# EAGLE design supply_test_2v0 (EAGLE 6.3)

## Sheet 1 of 3: AC-DC Power Supply
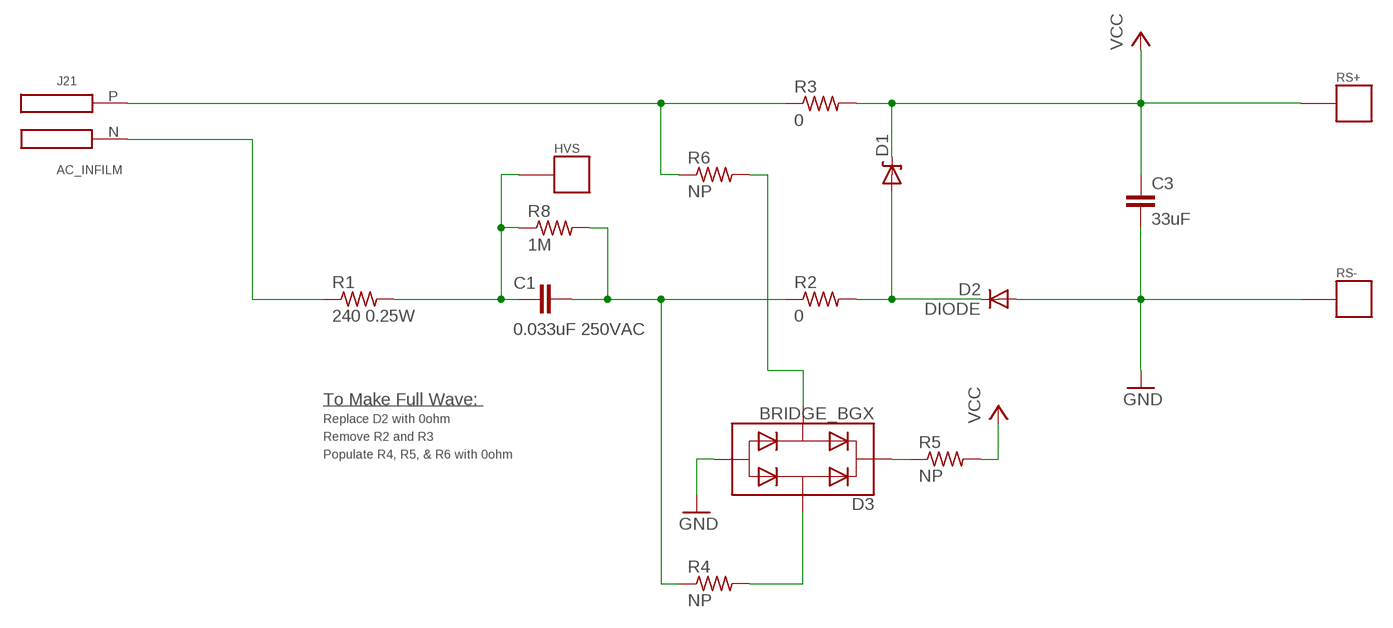
[diagram p0: schematic, sheet 1]

### Parts
C1  0.033uF 250VAC  C-EUC2220K  [C2220K]
C3  33uF  C-EUC0603  [C0603]
D1  ZENERBZT52  [BZT52]
D2  DIODE  [BAS521]
D3  BRIDGE_BGX  [TO-253-4]
HVS  TP_STD  [TP]
J21  AC_INFILM  [AC3_FILM]
R1  240 0.25W  R-US_R0603  [R0603]
R2  0  R-US_R0603  [R0603]
R3  0  R-US_R0603  [R0603]
R4  NP  R-US_R0603  [R0603]
R5  NP  R-US_R0603  [R0603]
R6  NP  R-US_R0603  [R0603]
R8  1M  R-US_R0603  [R0603]
RS+  TP_STD  [TP]
RS-  TP_STD  [TP]

### Nets
GND: C3.2 D2.A D3.P3 RS-.P$1 ; also sheet 2,3
N$1: C1.2 HVS.P$1 R1.2 R8.1
N$2: J21.N R1.1
N$3: D1.A D2.C R2.2
N$4: C1.1 R2.1 R4.1 R8.2
N$5: D3.P4 R4.2
N$6: J21.P R3.1 R6.1
N$7: D3.P1 R5.1
N$8: D3.P2 R6.2
VCC: C3.1 D1.C R3.2 R5.2 RS+.P$1 ; also sheet 2

### Notes on the sheet
- To Make Full Wave:
- Replace D2 with 0ohm
- Remove R2 and R3
- Populate R4, R5, & R6 with 0ohm

## Sheet 2 of 3: Load Supply Regulation
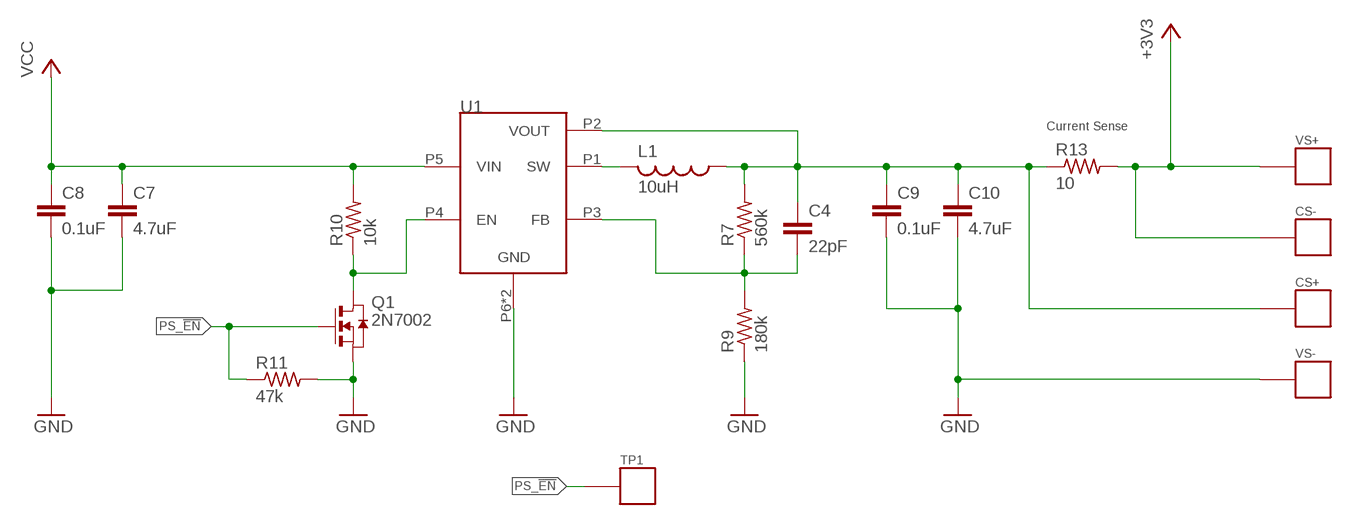
[diagram p1: schematic, sheet 2]

### Parts
C4  22pF  C-EUC0603  [C0603]
C7  4.7uF  C-EUC0402  [C0402]
C8  0.1uF  C-EUC0402  [C0402]
C9  0.1uF  C-EUC0402  [C0402]
C10  4.7uF  C-EUC0603  [C0603]
CS+  TP_STD  [TP]
CS-  TP_STD  [TP]
L1  10uH  L-USL0805  [L0805]
Q1  2N7002  [SC-70-3]
R7  560k  R-US_R0603  [R0603]
R9  180k  R-US_R0603  [R0603]
R10  10k  R-US_R0402  [R0402]
R11  47k  R-US_R0603  [R0603]
R13  10  R-US_R0603  [R0603]
TP1  TP_STD  [TP]
U1  TPS62122  [WDFN-6]
VS+  TP_STD  [TP]
VS-  TP_STD  [TP]

### Nets
+3V3: CS-.P$1 R13.2 VS+.P$1 ; also sheet 3
GND: C7.2 C8.2 C9.2 C10.2 Q1.P2(S) R9.1 R11.2 U1.P6(GND) U1.PAD(GND) VS-.P$1 ; also sheet 1,3
N$9: L1.2 U1.P1(SW)
N$11: C4.1 C9.1 C10.1 CS+.P$1 L1.1 R7.2 R13.1 U1.P2(VOUT)
N$13: C4.2 R7.1 R9.2 U1.P3(FB)
N$16: Q1.P3(D) R10.1 U1.P4(EN)
PS_!EN!: Q1.P1(G) R11.1 TP1.P$1
VCC: C7.1 C8.1 R10.2 U1.P5(VIN) ; also sheet 1

### Notes on the sheet
- Current Sense

## Sheet 3 of 3: Load Selection
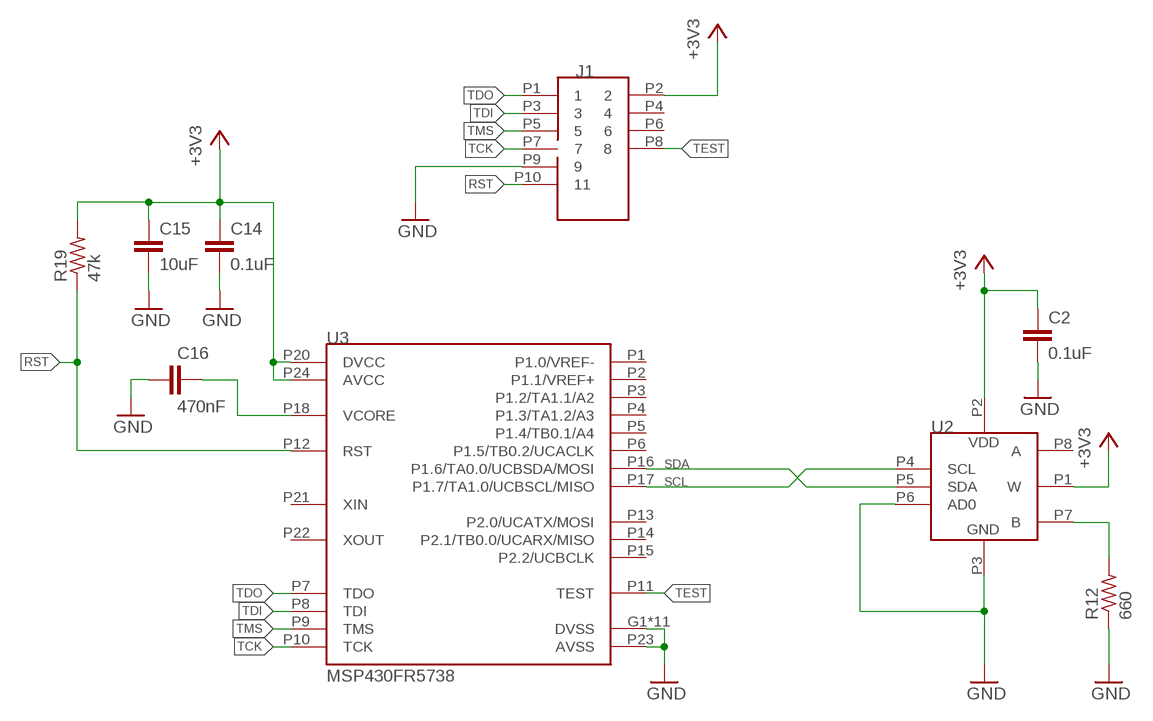
[diagram p2: schematic, sheet 3]

### Parts
C2  0.1uF  C-EUC0603  [C0603]
C14  0.1uF  C-EUC0603  [C0603]
C15  10uF  C-EUC0603  [C0603]
C16  470nF  C-EUC0603  [C0603]
J1  JTAG_14PIN_IDC-NL  [TC2050-IDC-NL-430]
R12  660  R-US_R0603  [R0603]
R19  47k  R-US_R0603  [R0603]
U2  AD524  [SOT-23-8]
U3  MSP430FR5738  [VQFN-24]

### Nets
+3V3: C2.1 C14.1 C15.1 J1.P2 R19.2 U2.P1(W) U2.P2(VDD) U3.P20(DVCC) U3.P24(AVCC) ; also sheet 2
GND: C2.2 C14.2 C15.2 C16.1 J1.P9 R12.1 U2.P3(GND) U2.P6(AD0) U3.G1(DVSS) U3.G2(DVSS) U3.G3(DVSS) U3.G4(DVSS) U3.G5(DVSS) U3.G6(DVSS) U3.G7(DVSS) U3.G8(DVSS) U3.G9(DVSS) U3.P19(DVSS) U3.P23(AVSS) U3.PAD(DVSS) ; also sheet 1,2
N$12: R12.2 U2.P7(B)
N$23: C16.2 U3.P18(VCORE)
RST: J1.P10 R19.1 U3.P12(RST)
SCL: U2.P4(SCL) U3.P17(P1.7/TA1.0/UCBSCL/MISO)
SDA: U2.P5(SDA) U3.P16(P1.6/TA0.0/UCBSDA/MOSI)
TCK: J1.P7 U3.P10(TCK)
TDI: J1.P3 U3.P8(TDI)
TDO: J1.P1 U3.P7(TDO)
TEST: J1.P8 U3.P11(TEST)
TMS: J1.P5 U3.P9(TMS)
Unconnected: J1.P4 J1.P6 U2.P8(A) U3.P1(P1.0/VREF-) U3.P2(P1.1/VREF+) U3.P3(P1.2/TA1.1/A2) U3.P4(P1.3/TA1.2/A3) U3.P5(P1.4/TB0.1/A4) U3.P6(P1.5/TB0.2/UCACLK) U3.P13(P2.0/UCATX/MOSI) U3.P14(P2.1/TB0.0/UCARX/MISO) U3.P15(P2.2/UCBCLK) U3.P21(XIN) U3.P22(XOUT)

## Library data of the parts
C1 = rcl:C-EU: CAPACITOR, European symbol; DIGIKEY: 490-4238-1-ND
C2 C14 = rcl:C-EU: CAPACITOR, European symbol; DIGIKEY: 445-1316-1-ND
C3 = rcl:C-EU: CAPACITOR, European symbol; DIGIKEY: 718-1672-1-ND
C4 = rcl:C-EU: CAPACITOR, European symbol; DIGIKEY: 399-1053-1-ND
C7 C10 = rcl:C-EU: CAPACITOR, European symbol; DIGIKEY: 587-2786-1-ND
C8 C9 = rcl:C-EU: CAPACITOR, European symbol; DIGIKEY: 1276-1001-1-ND
C15 = rcl:C-EU: CAPACITOR, European symbol; DIGIKEY: 1276-1119-1-ND
C16 = rcl:C-EU: CAPACITOR, European symbol; DIGIKEY: 445-5192-1-ND
CS+ CS- RS+ RS- TP1 VS+ VS- = skyspecs:TP; DIGIKEY: NP
D1 = powerfilm:ZENER; DIGIKEY: BZT52C10T-7DICT-ND; DIGIKEY_2: BZT52C15T-7DICT-ND
D2 = powerfilm:DIODE; DIGIKEY: BAS521-7DICT-ND
D3 = powerfilm:BRIDGE_BGX; DIGIKEY: BGX50AINCT-ND
HVS = skyspecs:TP; DIGIKEY: 5000K-ND
J1 = ibat:JTAG_14PIN; DIGIKEY: NP; TAG-CONNECT: TC2050-IDC-NL-430
J21 = powerfilm:AC_IN; DIGIKEY: NP
L1 = rcl:L-US: INDUCTOR, American symbol; DIGIKEY: 490-4990-1-ND
Q1 = nav:2N7002; DIGIKEY: 2N7002WCT-ND
R1 = rcl:R-US_: RESISTOR, American symbol; DIGIKEY: RHM240DCT-ND
R2 R3 = rcl:R-US_: RESISTOR, American symbol; DIGIKEY: P0.0GCT-ND
R4-R6 = rcl:R-US_: RESISTOR, American symbol; DIGIKEY: NP
R7 = rcl:R-US_: RESISTOR, American symbol; DIGIKEY: P560KHCT-ND
R8 = rcl:R-US_: RESISTOR, American symbol; DIGIKEY: MCT0603-1.00M-CFCT-ND
R9 = rcl:R-US_: RESISTOR, American symbol; DIGIKEY: P180KHCT-ND
R10 = rcl:R-US_: RESISTOR, American symbol; DIGIKEY: P10KJCT-ND
R11 R19 = rcl:R-US_: RESISTOR, American symbol; DIGIKEY: P47KGCT-ND
R12 = rcl:R-US_: RESISTOR, American symbol; DIGIKEY: P665HCT-ND
R13 = rcl:R-US_: RESISTOR, American symbol; DIGIKEY: CRT0603-BY-10R0ELFCT-ND
U1 = powerfilm:TPS62122; DIGIKEY: 296-27695-1-ND
U2 = powerfilm:AD524; DIGIKEY: AD5245BRJZ10-R2CT-ND
U3 = powerfilm:MSP430FR5738; DIGIKEY: 296-29232-1-ND

## Board
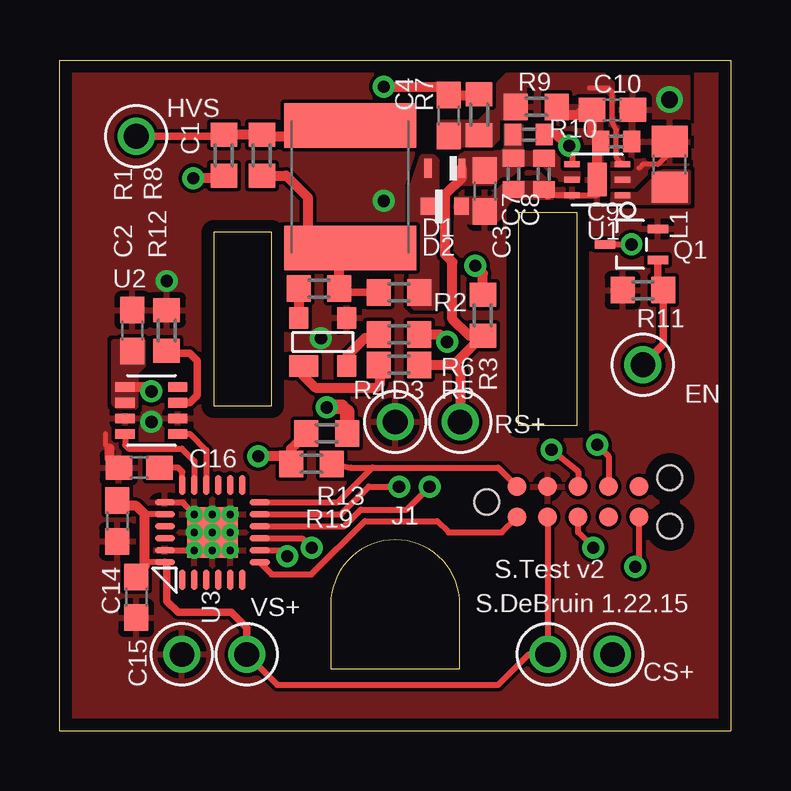
[diagram p3: board, top side]
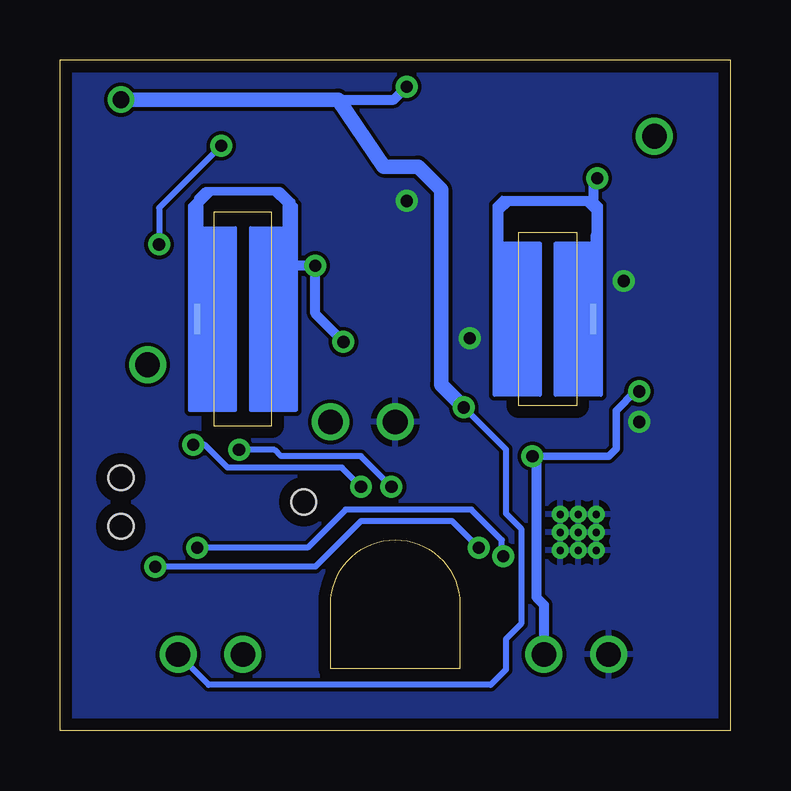
[diagram p4: board, bottom side, seen from below]

Size 27.94 x 27.94 mm. Coordinates in mm from the lower left corner, seen from the top.
Copper layers (1*16): Top 0.0178mm / dielectric 59mil / Bottom 0.0178mm
Design rules "SSC-EAGLE-2Lyr_v1.0.0.3": minimum track width 6mil, minimum drill 14mil, track to track 6mil, track to pad 6mil, pad to pad 6mil, via to via 6mil, smd to smd 6mil, copper to edge 20mil, drill to drill 16mil, minimum pad ring 8mil, minimum via ring 8mil, stop-mask expansion 3mil, vias tented up to drill 0mil, thermal gap 10mil

### Footprints (pad centres in the part's own frame; a part is rotated, then mirrored left to right if it is on the bottom)
C2220K = smd 1.85 x 5.5: 1 -2.55,0; 2 2.55,0
C0603 = smd 1.1 x 1: 1 -0.85,0; 2 0.85,0
C0402 = smd 0.7 x 0.9: 1 -0.65,0; 2 0.65,0
TP = drill 1.029: P$1 0,0
BZT52 = smd 0.3 x 0.8: A -0.7,0; C 0.7,0
BAS521 = smd 0.6 x 0.7: A -0.7,0; C 0.7,0
TO-253-4 = smd 1.2 x 0.9: P1 -0.8,-1 | smd 0.8 x 0.9: P2 1,-1; P3 1,1; P4 -1,1
TC2050-IDC-NL-430 = smd 0.787 x 0.787: P1 -2.54,-0.635; P2 -1.27,-0.635; P3 0,-0.635; P4 1.27,-0.635; P5 2.54,-0.635; P6 2.54,0.635; P7 1.27,0.635; P8 0,0.635; P9 -1.27,0.635; P10 -2.54,0.635 | hole 1.029: -3.81,0; 3.81,1.016; 3.81,-1.016
AC3_FILM = smd 0.254 x 1.27 bottom: N -8.255,0; P 8.255,0
L0805 = smd 1.3 x 1.5: 1 -0.95,0; 2 0.95,0
SC-70-3 = smd 0.85 x 0.35: P1 -1.1,0.65; P2 -1.1,-0.65; P3 1.1,0
R0603 = smd 1 x 1.1: 1 -0.85,0; 2 0.85,0
R0402 = smd 0.7 x 0.9: 1 -0.65,0; 2 0.65,0
WDFN-6 = smd 0.65 x 0.25: P1 -1.05,0.65; P2 -1.05,0; P3 -1.05,-0.65; P4 1.05,-0.65; P5 1.05,0; P6 1.05,0.65 | smd 0.8 x 1.4: PAD 0,0
SOT-23-8 = smd 0.8 x 0.4: P1 -1.1,0.975; P2 -1.1,0.325; P3 -1.1,-0.325; P4 -1.1,-0.975; P5 1.1,-0.975; P6 1.1,-0.325; P7 1.1,0.325; P8 1.1,0.975
VQFN-24 = drill 0.3 pad 0.5: G1 -0.75,0.75; G2 0,0.75; G3 0.75,0.75; G4 -0.75,0; G5 0,0; G6 0.75,0; G7 -0.75,-0.75; G8 0,-0.75; G9 0.75,-0.75 | smd 0.85 x 0.28: P1 -1.975,1.25; P2 -1.975,0.75; P3 -1.975,0.25; P4 -1.975,-0.25; P5 -1.975,-0.75; P6 -1.975,-1.25; P13 1.975,-1.25; P14 1.975,-0.75; P15 1.975,-0.25; P16 1.975,0.25; P17 1.975,0.75; P18 1.975,1.25 | smd 0.28 x 0.85: P7 -1.25,-1.975; P8 -0.75,-1.975; P9 -0.25,-1.975; P10 0.25,-1.975; P11 0.75,-1.975; P12 1.25,-1.975; P19 1.25,1.975; P20 0.75,1.975; P21 0.25,1.975; P22 -0.25,1.975; P23 -0.75,1.975; P24 -1.25,1.975 | smd 2.1 x 2.1: PAD 0,0

### Placement (x,y rotation side)
C1  12.09,22.66 90 top
C2  3.02,16.67 90 top
C3  17.7,22.48 270 top
C4  16.19,25.63 270 top
C7  18.89,23.19 270 top
C8  20.16,23.19 270 top
C9  23.18,24.54 180 top
C10  23.02,25.86 180 top
C14  2.38,8.73 270 top
C15  3.18,5.56 270 top
C16  3.3,10.95 0 top
CS+  23.02,3.17 0 top
CS-  20.32,3.17 0 top
D1  16.03,23.43 0 top
D2  16.03,21.84 180 top
D3  10.95,16.19 0 top
HVS  3.18,24.77 0 top
J1  21.59,9.52 0 top
J21  13.97,17.14 0 top
L1  25.4,23.59 270 top
Q1  23.81,20.26 180 top
R1  6.83,23.97 90 top
R2  14.13,18.26 0 top
R3  17.62,17.3 270 top
R4  10.8,18.41 180 top
R5  14.13,15.24 0 top
R6  14.13,16.51 180 top
R7  17.46,25.65 90 top
R8  8.41,23.97 270 top
R9  19.84,25.98 180 top
R10  19.53,24.83 180 top
R11  24.29,18.35 180 top
R12  4.45,16.67 270 top
R13  11.11,12.38 180 top
R19  10.48,11.11 180 top
RS+  16.67,12.86 0 top
RS-  13.97,12.86 0 top
TP1  24.29,15.24 0 top
U1  22.38,22.96 180 top
U2  3.81,13.33 0 top
U3  6.35,8.25 90 top
VS+  7.78,3.17 0 top
VS-  5.08,3.17 0 top

### Tracks (layer width: path | path; a pad name or v marks a point on that pad's centre or on a via)
+3V3  (via drill 0.51)
  Top 0.254: U3.P20 3.54,9 | 2.6,9.37 C14.1 | U3.P24 3.67,7 3.18,6.51 | 3.12,6.51 C15.1 | J1.P2 CS-.P$1 19.53,3.17 18.26,1.9 9.05,1.9 VS+.P$1
  Top 0.305: U3.P24 4.45,6.93 4.45,5.4 4.92,4.92 7.14,4.92 7.78,4.29 VS+.P$1
  Top 0.406: 2.6,9.37 3.18,9.37 3.54,9 3.54,6.87 3.18,6.51 3.12,6.51 | R13.2 9.63,11.75 R19.2 9.31,11.43 v8.26,11.43 | v3.81,14.13 3.63,14.31 U2.P1
  Bottom 0.305: v8.26,11.43 5.08,11.43 4.76,11.75 4.76,13.33 3.97,14.13 v3.81,14.13
  Bottom 0.406: v8.26,11.43 8.1,11.27 8.1,5.56 7.78,5.24 VS+.P$1
  pour Top (no thermals): 2.38,13.49 3.18,13.49 3.18,14.92 3.49,15.24 3.49,16.19 2.22,16.19 2.22,13.65
GND  (via drill 0.51)
  Top 0.203: 2.06,11.75 1.91,11.91 1.91,12.38 | 22.07,25.81 22.12,25.81 C10.2
  Top 0.254: U3.P23 U3.G1 U3.G4 | U3.G9 U3.G6 U3.G3 5.1,9.5 U3.P19 | U3.G8 U3.G7 | U1.PAD 22.38,22.32 22.37,22.3 U1.P6 20.4,22.3 20.32,22.23
  Top 0.406: C16.1 2.06,11.34 2.06,11.75 | C10.2 22.17,24.9 C9.2 22.38,24.4 U1.PAD | R9.1 21.02,25.65 21.59,25.65 21.75,25.81 22.07,25.81 22.23,25.65 22.23,25.49
  other vias: 10.87,16.35 13.49,22.07 4.45,18.73 3.81,12.86
  pour Top (rank 6): 0,28.57 27.94,28.57 27.94,-0.64 0,-0.64
  pour Top (rank 2, no thermals): 20.48,22.8 18.57,22.8 17.94,22.16 16.51,22.16 16.51,21.21 18.1,21.21 18.57,21.56 20.48,20.8
  pour Bottom (rank 6): 0,28.57 27.94,28.57 27.94,-0.64 0,-0.64
  pour Top (rank 2): 4.92,9.37 1.75,9.37 1.75,13.33 3.97,13.33 4.76,12.54 4.92,12.38
N$1
  Top 0.305: HVS.P$1 6.77,24.77 R1.2
  Top 0.406: R1.2 R8.1 8.47,24.77 10.16,24.77 10.6,25.21 C1.2
N$2  (via drill 0.51)
  Top 0.406: R1.1 6.72,23.02 v5.56,23.02
  Bottom 0.254: 5.71,22.07 5.56,21.91 5.56,20.8 5.71,20.64 J21.N
  Bottom 0.406: v5.56,23.02 5.71,22.86 5.71,22.07
N$3
  pour Top (no thermals): 15.72,23.75 15.56,23.91 15.08,23.91 14.61,22.54 14.61,17.78 14.76,17.62 15.56,17.62 15.72,17.78
N$4
  Top 0.305: R4.1 11.8,18.26 R2.1
  Top 0.406: R8.2 9.42,23.12 10.32,22.23 10.32,19.84 10.16,19.68 11.43,19.68 | 11.43,19.68 11.67,19.68 C1.1 | R4.1 11.64,19.47 11.43,19.68
N$5
  Top 0.406: R4.2 D3.P4
N$6  (via drill 0.51)
  Top 0.406: R3.1 17.62,19.05 v17.3,19.37 | R6.1 15.81,16.51 v16.13,16.19
  Bottom 0.203: 18.26,19.37 18.26,21.68 | 22.23,21.84 J21.P
  Bottom 0.254: 18.26,21.68 18.26,22.03 18.73,22.51 21.91,22.51 22.23,22.19 22.23,21.84
  Bottom 0.406: 18.26,19.37 v17.3,19.37 17.3,17.37 v16.13,16.19
N$7
  Top 0.406: D3.P1 10.15,14.77 10.64,14.29 13.18,14.29 13.34,14.45 13.34,15.18 R5.1
N$8
  Top 0.406: D3.P2 11.95,15.61 12.7,16.35 13.12,16.35 R6.2
N$9
  pour Top (rank 2, no thermals): 23.02,22 26.19,22 26.19,23.27 24.29,23.27 23.65,22.64 23.02,22.64
N$11  (via drill 0.51, 0.7)
  Top 0.203: L1.1 25.4,24.07 24.92,23.59 24.29,23.59 24.13,23.43
  Top 0.254: 16.16,26.45 C4.1
  Top 0.406: R7.2 17.44,26.48 C4.1 15.84,26.83 v13.49,26.83
  Top 0.61: R13.1 11.96,13.28 11.75,13.49 11.14,13.49 v11.11,13.46
  Bottom 0.254: v11.11,13.46 9.37,11.72 9.37,9.05 8.73,8.41 8.73,4.45 9.37,3.81 9.37,2.54 10,1.9 21.75,1.9 CS+.P$1
  Bottom 0.406: 16.35,26.29 14.03,26.29 v13.49,26.83
  Bottom 0.61: v25.4,26.29 16.35,26.29 14.45,23.49 13.02,23.49 12.07,22.54 12.07,14.41 v11.11,13.46
  pour Top (rank 3): 23.34,27.24 26.19,27.24 26.19,23.59 24.61,23.59 23.81,22.8 23.02,22.8 23.02,23.43 23.18,23.43 23.65,23.91 23.65,24.38 23.34,24.7
  pour Top (no thermals): 23.02,22.64 23.81,22.64 24.61,23.43 24.61,23.59 23.34,23.59 23.02,23.27
N$12
  Top 0.305: U2.P7 5.41,13.66 5.71,13.97 5.71,15.4 5.4,15.72 4.55,15.72 R12.2
N$13
  Top 0.203: U1.P3 23.18,23.88 23.18,25.02 23.02,25.34 23.02,26.61 22.86,26.77 22.07,26.77
  pour Top (rank 4, no thermals): 15.88,24.38 17.94,24.38 19.37,25.81 19.37,26.92 18.57,26.92 18.26,26.61 18.26,26.13 17.46,25.34 15.88,25.34
  pour Top (rank 4): 22.86,23.43 23.81,23.43 23.81,26.13 22.54,27.4 18.73,27.4 18.26,26.92 18.26,25.65 21.91,25.65 22.86,24.7
N$16  (via drill 0.51)
  Top 0.254: Q1.P3 v23.81,20.26 | v21.22,24.37 21.33,24.26 U1.P4
  Top 0.406: R10.1 20.64,24.86 21.11,24.48 v21.22,24.37
  Bottom 0.254: v21.22,24.37 23.81,21.78 v23.81,20.26
N$23
  Top 0.254: U3.P18 5.1,10.77 4.92,10.95 C16.2
PS_!EN!
  Top 0.305: Q1.P1 24.91,18.58 R11.1 25.14,16.09 TP1.P$1
RST
  Top 0.254: U3.P12 11.57,9.5 13.02,10.95 | 13.02,10.95 18.26,10.95 J1.P10 | R19.1 12.12,10.95 13.02,10.95
SCL
  Top 0.254: U2.P4 2.71,11.89 2.86,11.75 5.08,11.75 5.6,11.23 U3.P17
SDA
  Top 0.254: U2.P5 5.42,12.36 6.1,11.68 U3.P16
TCK  (via drill 0.51)
  Top 0.254: U3.P10 11.84,8.5 12.54,9.21 14.45,9.21 v15.4,10.16 | v22.38,11.91 22.86,11.43 J1.P7
  Bottom 0.254: v15.4,10.16 16.19,10.95 20.96,10.95 21.91,11.91 v22.38,11.91
TDI  (via drill 0.51)
  Top 0.254: U3.P8 9.23,7.5 v9.47,7.26 | v22.23,7.62 21.59,8.25 J1.P3
  Bottom 0.254: v9.47,7.26 9.53,7.31 9.53,7.94 10.8,9.21 16.03,9.21 17.62,7.62 v22.23,7.62
TDO
  Top 0.254: U3.P7 8.82,6.51 10.48,6.51 12.7,8.73 15.72,8.73 16.19,8.25 18.41,8.25 J1.P1
TEST  (via drill 0.51)
  Top 0.254: U3.P11 11.7,9 12.86,10.16 v14.13,10.16 | v20.48,11.7 21.59,10.79 J1.P8
  Bottom 0.254: v14.13,10.16 15.4,11.43 18.73,11.43 19,11.7 v20.48,11.7
TMS  (via drill 0.51)
  Top 0.254: U3.P9 10.09,8 v10.49,7.62 | v23.97,6.83 24.13,6.98 J1.P5
  Bottom 0.254: v10.49,7.62 11.6,8.73 15.4,8.73 17.3,6.83 v23.97,6.83
VCC
  Top 0.406: D1.C 16.73,23.02 16.03,22.32 16.03,19.84 16.35,19.53 16.35,17.14 17.04,16.45 R3.2 16.41,15.24 | R5.2 16.41,15.24 | 16.41,15.24 16.67,14.98 RS+.P$1
  pour Top (no thermals): 21.59,22.96 20.8,22.96 20.16,23.59 18.57,23.59 18.57,24.07 20.8,24.07 21.59,23.27
  pour Top (rank 3, no thermals): 16.67,22.8 18.41,22.8 19.21,23.59 19.21,25.5 18.57,25.5 18.57,24.23 18.41,24.07 16.83,24.07 16.67,23.91

### Text on the board
tPlace: HVS | EN | RS+ | S.Test v2 | VS+ | S.DeBruin | 1.22.15 | CS+